# EAGLE design MODUL_STEP_V100 (EAGLE 6.4)
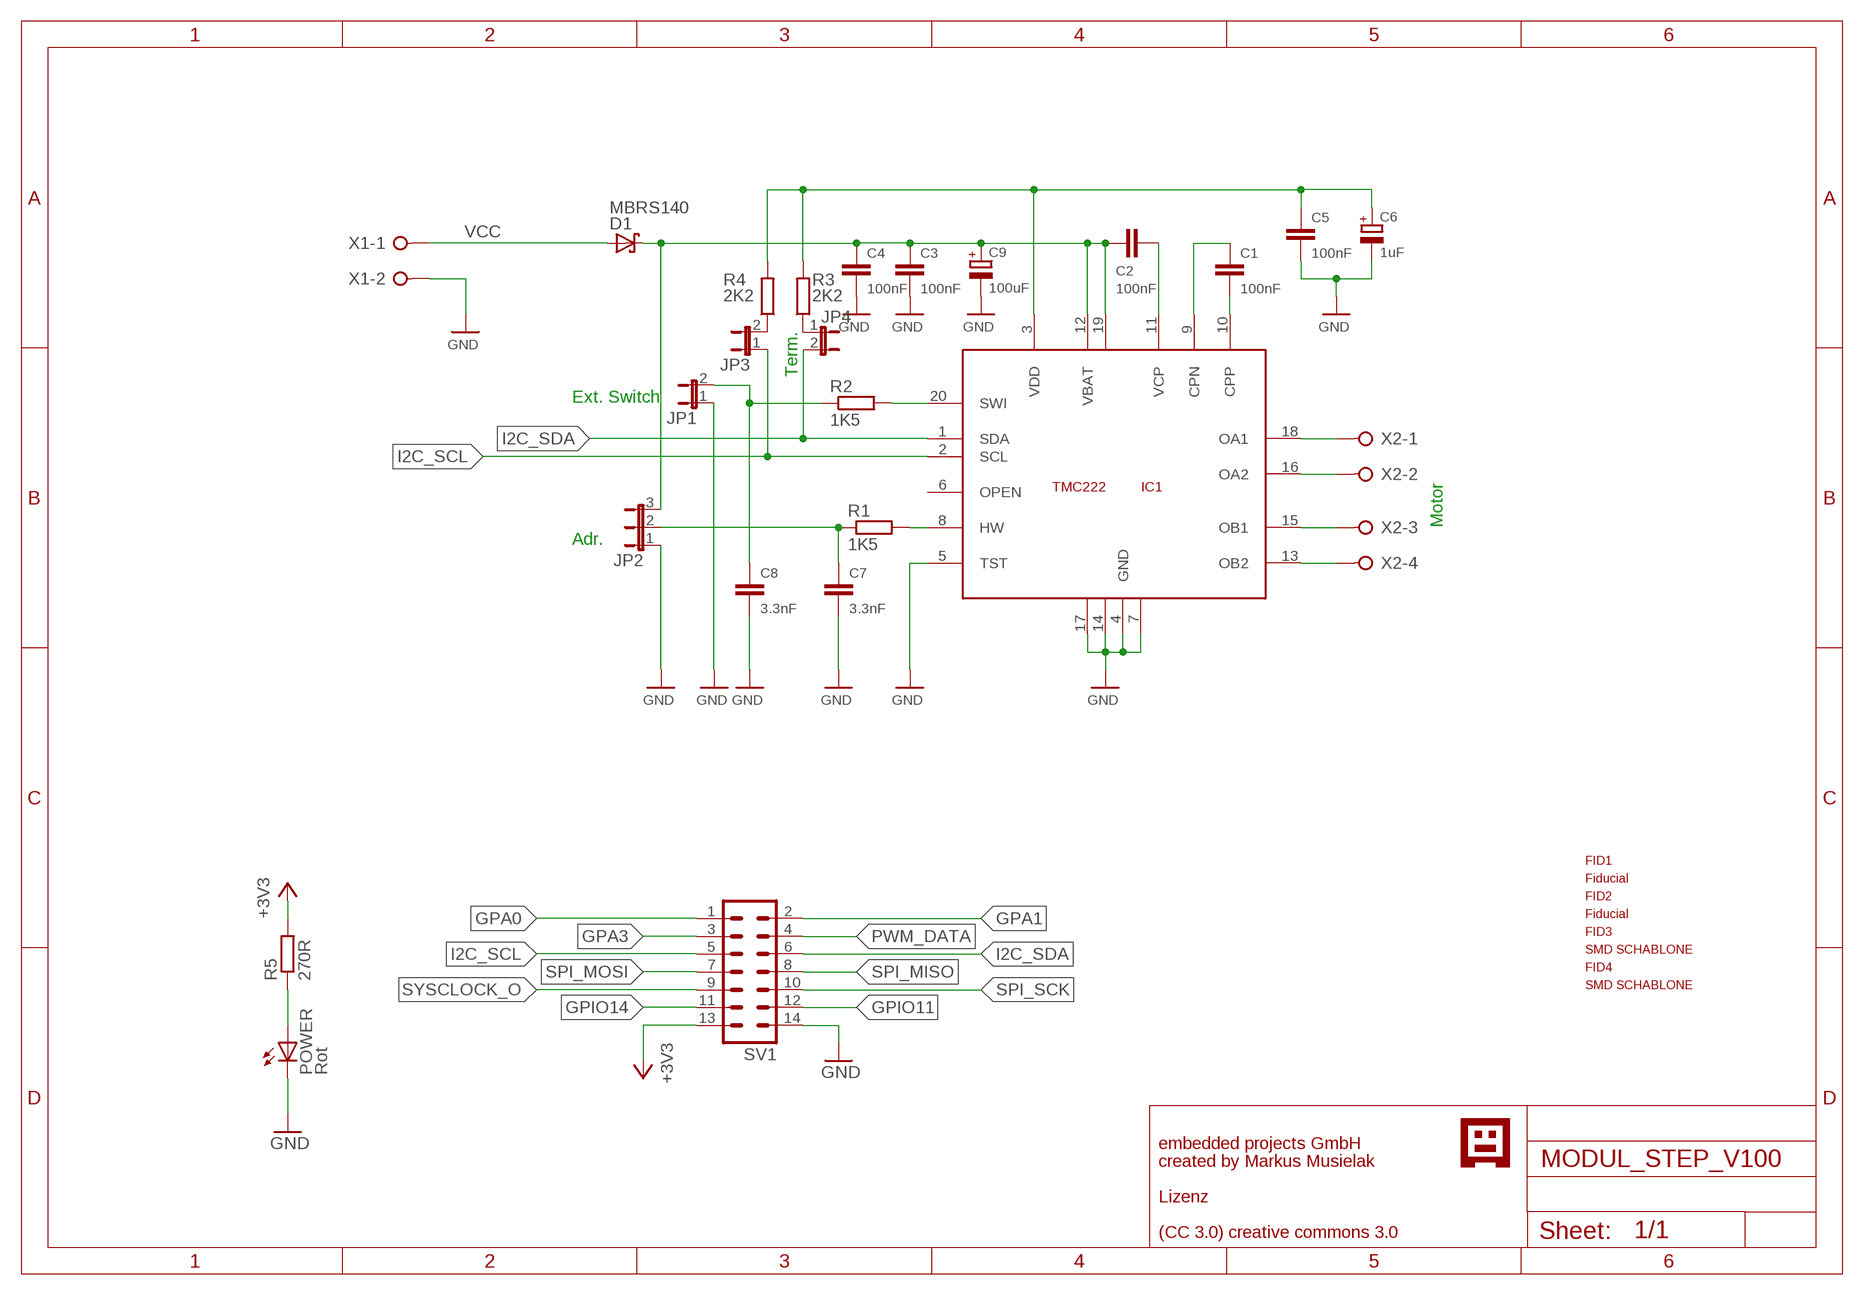
[diagram p0: schematic, sheet 1]

## Parts
C1  100nF  C-EUC0805  [C0805]
C2  100nF  C-EUC0805  [C0805]
C3  100nF  C-EUC0805  [C0805]
C4  100nF  C-EUC0805  [C0805]
C5  100nF  C-EUC0805  [C0805]
C6  1uF  CPOL-EUB/3528-21R  [B/3528-21R]
C7  3.3nF  C-EUC0805  [C0805]
C8  3.3nF  C-EUC0805  [C0805]
C9  100uF  CPOL-EUE5-10.5  [E5-10,5]
D1  MBRS140  SCHOTTKY-DIODESMD  [SMB]
FID1  PASSERMARKEN_FIDUCIAL  [PASSERMARKEN_FIDUCIAL]
FID2  PASSERMARKEN_FIDUCIAL  [PASSERMARKEN_FIDUCIAL]
FID3  PASSERMARKEN_FIDUCIAL  [PASSERMARKEN_FIDUCIAL]
FID4  PASSERMARKEN_FIDUCIAL  [PASSERMARKEN_FIDUCIAL]
IC1  TMC222  [SOIC20]
JP1  JP1E  [JP1]
JP2  JP2E  [JP2]
JP3  JP1E  [JP1]
JP4  JP1E  [JP1]
POWER  Rot  LEDCHIP-LED0805  [CHIP-LED0805]
R1  1K5  R-EU_R0805  [R0805]
R2  1K5  R-EU_R0805  [R0805]
R3  2K2  R-EU_R0805  [R0805]
R4  2K2  R-EU_R0805  [R0805]
R5  270R  R-EU_R0805  [R0805]
SV1  ML14  [ML14]
U$1  GNUBLINLOGOSIEB  [GNUSIEBDRUCK]
X1  W237-02P  [W237-132]
X2  W237-04P  [W237-4P]

## Nets
+3V3: R5.2 SV1.13
GND: C3.2 C4.2 C5.2 C6.- C7.2 C8.2 C9.- IC1.4(GND) IC1.5(TST) IC1.7(GND2) IC1.14(GND3) IC1.17(GND4) JP1.1 JP2.1 POWER.C SV1.14 X1.2
GPA0: SV1.1
GPA1: SV1.2
GPA3: SV1.3
GPIO11: SV1.12
GPIO14: SV1.11
I2C_SCL: IC1.2(SCL) JP3.1 SV1.5
I2C_SDA: IC1.1(SDA) JP4.2 SV1.6
N$1: POWER.A R5.1
N$2: C1.1 IC1.9(CPN)
N$3: C1.2 IC1.10(CPP)
N$4: C2.2 IC1.11(VCP)
N$5: C2.1 C3.1 C4.1 C9.+ D1.C IC1.12(VBAT) IC1.19(VBAT2) JP2.3
N$6: IC1.8(HW) R1.2
N$7: C7.1 JP2.2 R1.1
N$8: C8.1 JP1.2 R2.1
N$9: IC1.20(SWI) R2.2
N$10: IC1.13(OB2) X2.4
N$11: IC1.15(OB1) X2.3
N$12: IC1.16(OA2) X2.2
N$13: IC1.18(OA1) X2.1
N$15: JP3.2 R4.1
N$16: JP4.1 R3.1
N$18: C5.1 C6.+ IC1.3(VDD) R3.2 R4.2
PWM_DATA: SV1.4
SPI_MISO: SV1.8
SPI_MOSI: SV1.7
SPI_SCK: SV1.10
SYSCLOCK_O: SV1.9
VCC: D1.A X1.1
Unconnected: IC1.6(OPEN)

## Notes on the sheet
- Term.
- Ext. Switch
- Motor
- Adr.
- embedded projects GmbH
- created by Markus Musielak
- Lizenz
- (CC 3.0) creative commons 3.0

## Library data of the parts
C1-C5 C7 C8 = rcl:C-EU: CAPACITOR, European symbol
C6 C9 = rcl:CPOL-EU: POLARIZED CAPACITOR, European symbol
D1 = diode:SCHOTTKY-DIODE: Schottky Diode
FID1 FID2 = KUBUS3:PASSERMARKEN_FIDUCIAL: SMD Passermarke
FID3 FID4 = SMDSCHABLONE:PASSERMARKEN_FIDUCIAL: SMD Passermarke
IC1 = tmc:TMC222: TMC222 Micro Stepping Stepper Motor Controller / Driver with Two Wire Serial Interface; FARNELL: 1214195
JP1 JP3 JP4 = jumper:JP1E: JUMPER
JP2 = jumper:JP2E: JUMPER
POWER = led:LED: LED OSRAM: - CHIPLED LG R971, LG N971, LY N971, LG Q971, LY Q971, LO R971, LY R971 LH N974, LH R974 LS Q976, LO Q976, LY Q976 LO Q996 - Hyper CHIPLED LW Q18S LB Q993, LB Q99A, LB R99A - SideLED LS A670, LO A670, LY A670, LG A670, LP A670 LB A673, LV A673, LT A673, LW A673 LH A674 LY A675 LS A676, LA A676, LO A676, LY A676, LW A676 LS A679, LY A679, LG A679 - Hyper Micro SIDELED® LS Y876, LA Y876, LO Y876, LY Y876 LT Y87S - SmartLED LW L88C, LW L88S LB L89C, LB L89S, LG L890 LS L89K, LO L89K, LY L89K LS L896, LA L896, LO L896, LY L896 - TOPLED LS T670, LO T670, LY T670, LG T670, LP T670 LSG T670, LSP T670, LSY T670, LOP T670, LYG T670 LG T671, LOG T671, LSG T671 LB T673, LV T673, LT T673, LW T673 LH T674 LS T676, LA T676, LO T676, LY T676, LB T676, LH T676, LSB T676, LW T676 LB T67C, LV T67C, LT T67C, LS T67K, LO T67K, LY T67K, LW E67C LS E67B, LA E67B, LO E67B, LY E67B, LB E67C, LV E67C, LT E67C LW T67C LS T679, LY T679, LG T679 LS T770, LO T770, LY T770, LG T770, LP T770 LB T773, LV T773, LT T773, LW T773 LH T774 LS E675, LA E675, LY E675, LS T675 LS T776, LA T776, LO T776, LY T776, LB T776 LHGB T686 LT T68C, LB T68C - Hyper Mini TOPLED® LB M676 - Mini TOPLED Santana® LG M470 LS M47K, LO M47K, LY M47K Source: http://www.osram.convergy.de LUXEON: - LUMILED® LXK2-PW12-R00, LXK2-PW12-S00, LXK2-PW14-U00, LXK2-PW14-V00 LXK2-PM12-R00, LXK2-PM12-S00, LXK2-PM14-U00 LXK2-PE12-Q00, LXK2-PE12-R00, LXK2-PE12-S00, LXK2-PE14-T00, LXK2-PE14-U00 LXK2-PB12-K00, LXK2-PB12-L00, LXK2-PB12-M00, LXK2-PB14-N00, LXK2-PB14-P00, LXK2-PB14-Q00 LXK2-PR12-L00, LXK2-PR12-M00, LXK2-PR14-Q00, LXK2-PR14-R00 LXK2-PD12-Q00, LXK2-PD12-R00, LXK2-PD12-S00 LXK2-PH12-R00, LXK2-PH12-S00 LXK2-PL12-P00, LXK2-PL12-Q00, LXK2-PL12-R00 Source: www.luxeon.com KINGBRIGHT: KA-3528ASYC Source: www.kingbright.com
R1-R4 = rcl:R-EU_: RESISTOR, European symbol
R5 = resistor:R-EU_: RESISTOR, European symbol
SV1 = con-ml:ML14: HARTING; OC_FARNELL: unknown; OC_NEWARK: unknown
U$1 = EmbeddedProjectsLogos2:GNUBLINLOGO
X1 = con-wago-508:W237-02P: WAGO SREW CLAMP; OC_FARNELL: unknown; OC_NEWARK: unknown
X2 = con-wago-508:W237-04P: WAGO SREW CLAMP; OC_FARNELL: unknown; OC_NEWARK: unknown

## Board
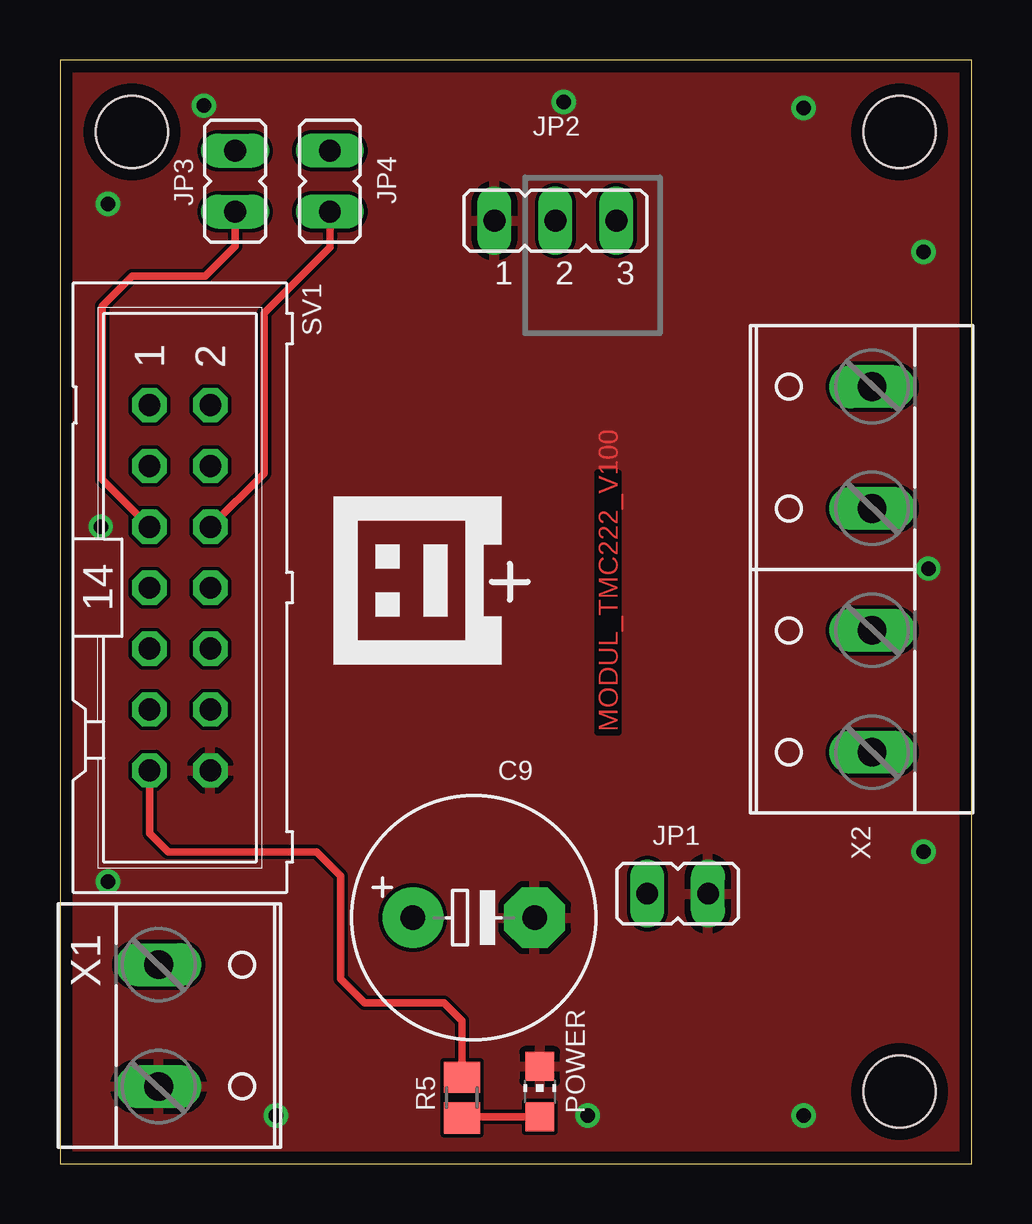
[diagram p1: board, top side]
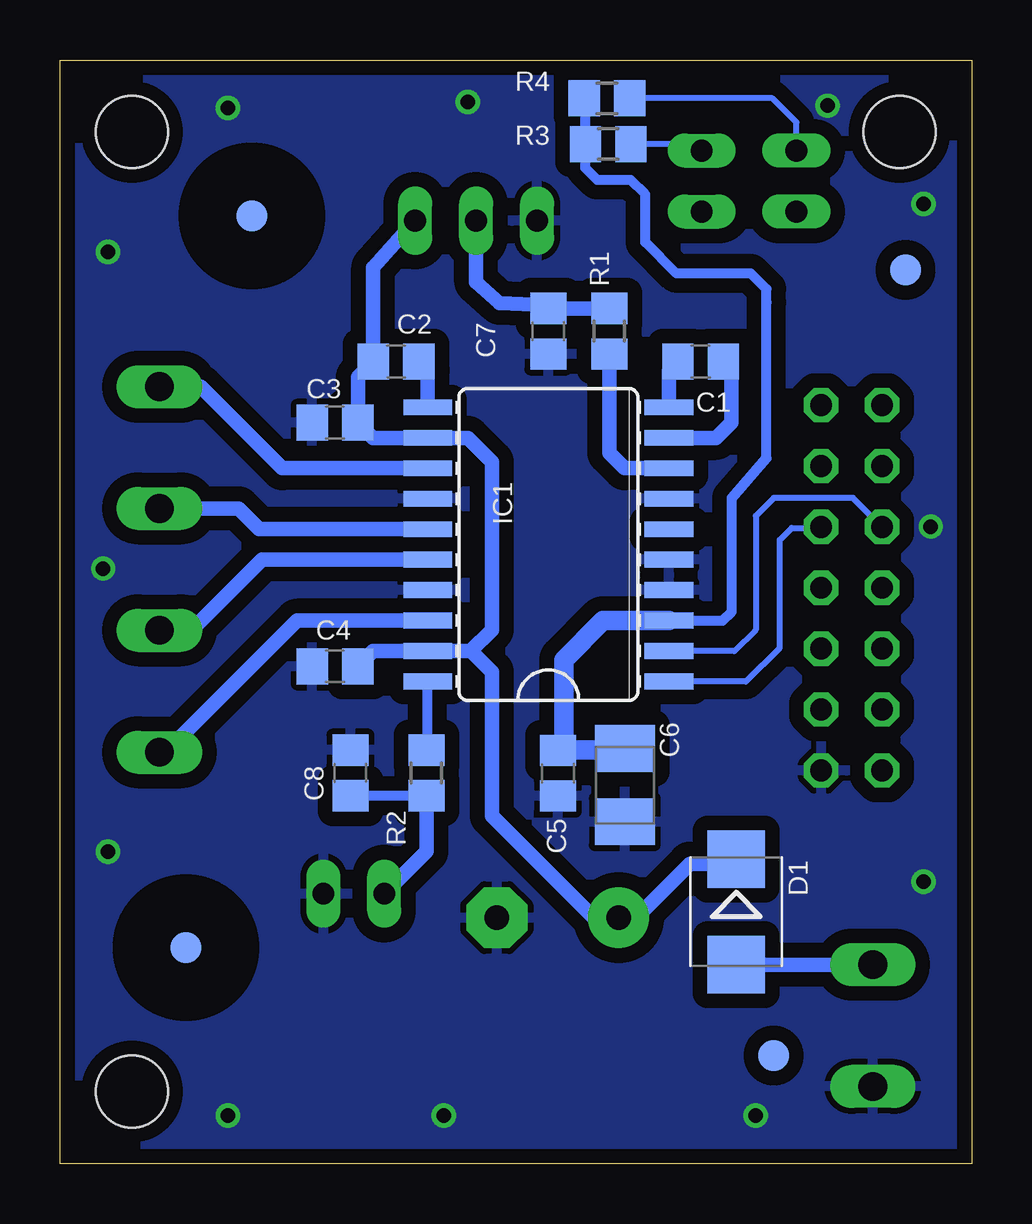
[diagram p2: board, bottom side, seen from below]

Size 38 x 46 mm. Coordinates in mm from the lower left corner, seen from the top.
Outline: 0,0 38,0 38,46 0,46 0,0
Copper layers (1*16): Top 0.035mm / dielectric 1.5mm / Bottom 0.035mm
Design rules "default *": minimum track width 10mil, minimum drill 24mil, track to track 6mil, track to pad 6mil, pad to pad 8mil, via to via 8mil, smd to smd 8mil, copper to edge 20mil, drill to drill 8mil, minimum pad ring 10mil, minimum via ring 8mil, stop-mask expansion 0mil, vias tented up to drill 40mil, thermal gap 10mil
Holes 3 mm at 35,43 3,43 35,3

### Footprints (pad centres in the part's own frame; a part is rotated, then mirrored left to right if it is on the bottom)
C0805 = smd 1.3 x 1.5: 1 -0.95,0; 2 0.95,0
B/3528-21R = smd 1.95 x 2.5: + 1.525,0; - -1.525,0
E5-10,5 = drill 1.016 pad 2.54: + -2.54,0 | drill 1.016 pad 2.54 octagon: - 2.54,0
SMB = smd 2.4 x 2.4: A 2.2,0; C -2.2,0
PASSERMARKEN_FIDUCIAL = smd 1.27 x 1.27: 1 0,0
SOIC20 = smd 0.66 x 2.032: 1 -5.715,-5.029; 2 -4.445,-5.029; 3 -3.175,-5.029; 4 -1.905,-5.029; 5 -0.635,-5.029; 6 0.635,-5.029; 7 1.905,-5.029; 8 3.175,-5.029; 9 4.445,-5.029; 10 5.715,-5.029; 11 5.715,5.029; 12 4.445,5.029; 13 3.175,5.029; 14 1.905,5.029; 15 0.635,5.029; 16 -0.635,5.029; 17 -1.905,5.029; 18 -3.175,5.029; 19 -4.445,5.029; 20 -5.715,5.029
JP1 = drill 0.914 long: 1 0,-1.27; 2 0,1.27
JP2 = drill 0.914 long: 1 -2.54,0; 2 0,0; 3 2.54,0
CHIP-LED0805 = smd 1.2 x 1.2: A 0,-1.05; C 0,1.05
R0805 = smd 1.3 x 1.5: 1 -0.95,0; 2 0.95,0
R0805' = smd 1.3 x 1.5: 1 -0.85,0; 2 0.85,0
ML14 = drill 0.914 octagon: 1 -7.62,-1.27; 2 -7.62,1.27; 3 -5.08,-1.27; 4 -5.08,1.27; 5 -2.54,-1.27; 6 -2.54,1.27; 7 0,-1.27; 8 0,1.27; 9 2.54,-1.27; 10 2.54,1.27; 11 5.08,-1.27; 12 5.08,1.27; 13 7.62,-1.27; 14 7.62,1.27
W237-132 = drill 1.194 long: 1 -2.54,-0.635; 2 2.54,-0.635
W237-4P = drill 1.194 long: 1 -7.62,-0.635; 2 -2.54,-0.635; 3 2.54,-0.635; 4 7.62,-0.635

### Placement (x,y rotation side)
C1  11.29,33.42 180 bottom
C2  23.99,33.42 0 bottom
C3  26.53,30.89 180 bottom
C4  26.53,20.73 180 bottom
C5  17.24,16.27 270 bottom
C6  14.45,15.78 90 bottom
C7  17.64,34.7 270 bottom
C8  25.89,16.28 90 bottom
C9  17.25,10.25 0 top
D1  9.8,10.49 270 bottom
FID1  32.75,9 0 bottom
FID2  30,39.5 0 bottom
FID3  2.75,37.25 0 bottom
FID4  8.25,4.5 0 bottom
IC1  17.64,25.8 90 bottom
JP1  25.75,11.25 90 top
JP2  20.65,39.3 0 top
JP3  7.3,40.95 0 top
JP4  11.25,40.95 180 top
POWER  20,3 0 top
R1  15.1,34.7 270 bottom
R2  22.72,16.28 90 bottom
R3  15.15,42.5 180 bottom
R4  15.2,44.4 180 bottom
R5  270R  [R0805']  16.75,2.75 90 top
SV1  5,24 270 top
U$1  18.4,20.8 90 top
X1  4.75,5.75 270 top
X2  33.23,24.77 90 top

### Tracks (layer width: path | path; a pad name or v marks a point on that pad's centre or on a via)
+3V3
  Top 0.305: R5.2 16.75,5.95 16,6.7 12.7,6.7 11.7,7.7 11.7,10.01 11.7,12 10.7,13 4.5,13 3.73,13.77 SV1.13
GND  (via drill 0.6)
  other vias: 9,2 31,2 22,2 36,13 2,11.75 2,40 21,44.25 31,44 36,38 36.2,24.8 1.7,26.55 6,44.1
  pour Bottom (isolate 0.61): -0.62,-0.82 38.8,-0.82 38.8,47.14 -0.62,47.14
  pour Top: -0.5,47.25 38.75,47.25 38.75,-1.25 -0.5,-1.25
I2C_SCL
  Top 0.305: JP3.1 7.3,38.25 6.05,37 3,37 1.75,35.75 1.75,28.52 SV1.5
  Bottom 0.254: IC1.2 9.89,21.36 9,22.25 9,27 8.25,27.75 4.94,27.75 SV1.5
I2C_SDA
  Top 0.305: JP4.2 11.25,38.2 8.5,35.45 8.5,28.77 SV1.6
  Bottom 0.254: IC1.1 9.41,20.09 8,21.5 8,26 7.5,26.5 6.31,26.5 SV1.6
N$1
  Top 0.254: R5.1 16.8,1.95
  Top 0.305: 16.8,1.95 POWER.A
N$2
  Bottom 0.406: 10.02,33.1 C1.1
  Bottom 0.61: IC1.9 10.65,30.25 10.02,30.89 10.02,33.1
N$3
  Bottom 0.406: 12.61,33.05 C1.2
  Bottom 0.61: IC1.10 12.61,33.05
N$4
  Bottom 0.406: 22.67,33.05 C2.2
  Bottom 0.61: IC1.11 22.67,33.05
N$5
  Bottom 0.61: C4.1 24.95,21.36 IC1.19 20.89,21.36 | 20.89,21.36 20,22.25 20,29.25 21,30.25 IC1.12 24.95,30.25 C3.1 25.58,32.78 C2.1 24.94,37.35 JP2.3 | 20.89,21.36 20.86,21.36 20,20.5 20,14.5 15.75,10.25 C9.+ 14,10.25 11.75,12.5 9.99,12.5 D1.C
N$6
  Bottom 0.61: IC1.8 14.46,28.98 15.1,29.61 R1.2
N$7
  Bottom 0.61: R1.1 C7.1 17.77,35.77 19.68,35.88 20.65,36.75 JP2.2
N$8
  Bottom 0.406: R2.1 C8.1
  Bottom 0.61: JP1.2 22.72,13.01 R2.1
N$9
  Bottom 0.406: IC1.20 22.67,17.28 R2.2
N$10
  Bottom 0.61: IC1.13 28.73,28.98 32.13,32.38 X2.4
N$11
  Bottom 0.61: IC1.15 29.69,26.44 30.55,27.3 X2.3
N$12
  Bottom 0.61: IC1.16 29.58,25.17 32.52,22.23 X2.2
N$13
  Bottom 0.61: IC1.18 28.12,22.63 33.6,17.14 X2.1
N$15
  Bottom 0.254: R4.1 8.3,44.4 7.3,43.4 JP3.2
N$16
  Bottom 0.254: R3.1 11.53,42.5 JP4.1
N$18
  Bottom 0.406: 17,17.23 C5.1 | C6.+ 14.52,17.23 | IC1.3 10.37,22.63 10,23 10,27.75 8.55,29.4 8.55,35.9 8.55,36.45 9.2,37.1 12.3,37.1 13.6,38.4 13.6,40.4 14.2,41 15.6,41 16.1,41.5 R3.2 16.1,44.35 R4.2
  Bottom 0.61: C6.+ 13.95,17.8
  Bottom 0.813: IC1.3 15.37,22.63 17,21 17,17.23 14.52,17.23
VCC
  Bottom 0.61: X1.1 D1.A

### Text on the board
Top: MODUL_TMC222_V100
tDocu: I2C-Pullup | Adresse | SCL | SDA | Low | High | B | OA4 | R | OA3 | Motor | W | OA2 | S | OA1 | www.gnublin.org | SWI | GND | VCC | Ext. Switch | Def.: Connected | GND | Motor Power